# Altium project FMC_SDR_XFE.PrjPcb (part 3 of 3)

## Sheet TGA3042.SchDoc: FMC SDR Frontend
size 420 x 297 mm; CheckedBy: -; CompanyName: CERN; DrawnBy: DrawnBy; Organization: CERN; Address1: European Organization for Nuclear Research; Address2: CH-1211 Genčve 23 - Switzerland; Revision: -; SheetNumber: -; SheetTotal: -; EDA_Number: EDA-XXXXX-VX-X; Projet: -; ModifiedBy: -; CreateDate: XX/XX/XXXX; CheckedDate: -; Title2: Power Amplifier; DivGrp: TE/MPE; Designer: Designer; ModifiedDate: -
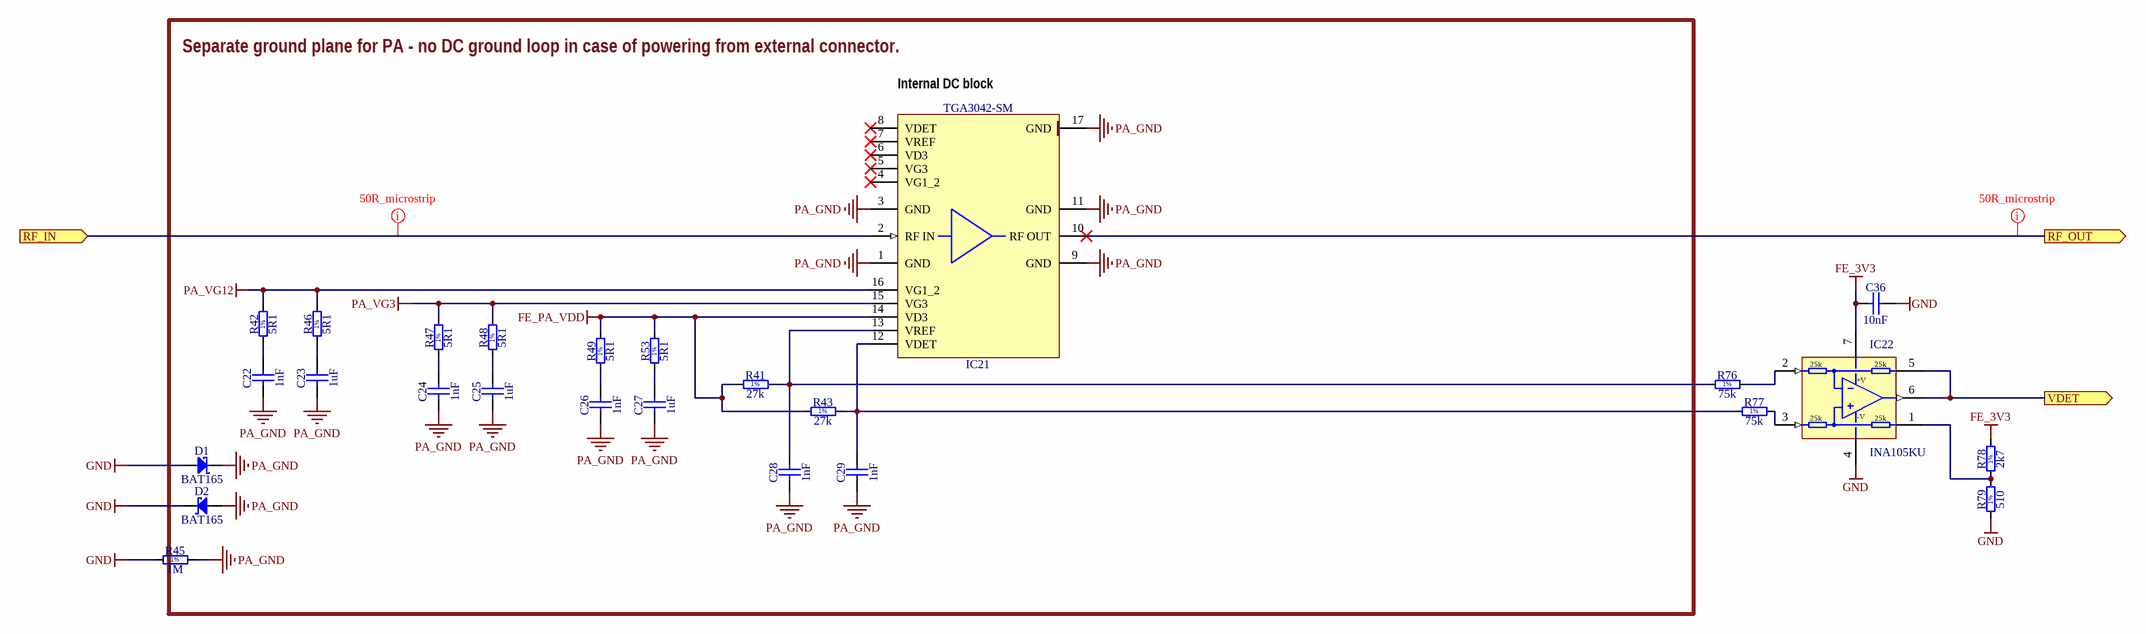
[diagram p9: TGA3042.SchDoc]

### Parts
C22  1nF  [CAPC1005X55N]
C23  1uF  [CAPC3216X140N]
C24  1nF  [CAPC1005X55N]
C25  1uF  [CAPC3216X140N]
C26  1nF  [CAPC1005X55N]
C27  1uF  [CAPC3216X140N]
C28  1nF  [CAPC1005X55N]
C29  1nF  [CAPC1005X55N]
C36  10nF  [CAPC1005X55N]
D1  BAT165  [SOD2512X110N]
D2  BAT165  [SOD2512X110N]
IC21  TGA3042-SM  [QORVO_TGA3042-SM]
IC22  INA105KU  [SOIC127P600X175-8N]
R41  27k  [RESC1005X40N]
R42  5R1  [RESC1005X40N]
R43  27k  [RESC1005X40N]
R45  1M  [RESC1005X40N]
R46  5R1  [RESC1005X40N]
R47  5R1  [RESC1005X40N]
R48  5R1  [RESC1005X40N]
R49  5R1  [RESC1005X40N]
R53  5R1  [RESC1005X40N]
R76  75k  [RESC1608X55N]
R77  75k  [RESC1608X55N]
R78  2k7  [RESC1608X55N]
R79  510  [RESC1608X55N]

### Ports
RF_IN (in), RF_OUT (out), VDET (out)

### Nets
FE_3V3: C36.1 IC22.7(+VCC) R78.2
FE_PA_VDD: IC21.14(VD3) R41.1 R43.1 R49.2 R53.2
GND: C36.2 D1.2(A) D2.1(C) IC22.4(-VEE) R45.1 R79.1
PA_GND: C22.1 C23.1 C24.1 C25.1 C26.1 C27.1 C28.1 C29.1 D1.1(C) D2.2(A) IC21.1(GND) IC21.3(GND) IC21.9(GND) IC21.11(GND) IC21.17(GND) R45.2
PA_VG3: IC21.15(VG3) R47.2 R48.2
PA_VG12: IC21.16(VG1_2) R42.2 R46.2
Vdet: IC22.5(SENS) IC22.6(OUT) ; port VDET
NetC22_2: C22.2 R42.1
NetC23_2: C23.2 R46.1
NetC24_2: C24.2 R47.1
NetC25_2: C25.2 R48.1
NetC26_2: C26.2 R49.1
NetC27_2: C27.2 R53.1
NetC28_2: C28.2 IC21.13(VREF) R41.2 R76.1
NetC29_2: C29.2 IC21.12(VDET) R43.2 R77.1
NetFL1_1: IC21.10(RF_OUT) ; port RF_OUT
NetFL2_3: IC21.2(RF_IN) ; port RF_IN
NetIC22_1: IC22.1(REF) R78.1 R79.2
NetIC22_2: IC22.2(IN-) R76.2
NetIC22_3: IC22.3(IN+) R77.2

Not connected (* = marked no-connect by the designer): IC21 4(VG1_2)* 5(VG3)* 6(VD3)* 7(VREF)* 8(VDET)*

### Layout directives
net class 50R_class: NetFL1_1, NetFL2_3

### Notes on the sheet
- Separate ground plane for PA - no DC ground loop in case of powering from external connector.
- (near IC21) Internal DC block
- Project/Equipment
- Document
- Designer
- Drawn by
- Check.by
- File
- Last Mod.
- Print Date
- Sheet
- Size
- A3
- of
- Rev
- (in symbol INA105KU) 25k; +V; -V
- (in symbol R0402_1M_1%_0.0625W_100PPM) 1%
- (in symbol R0402_5R1_1%_0.0625W_100PPM) 1%
- (in symbol R0402_27K_1%_0.0625W_100PPM) 1%
- (in symbol R0603_2K7_1%_0.1W_100PPM) 1%
- (in symbol R0603_75K_1%_0.1W_100PPM) 1%
- (in symbol R0603_510R_1%_0.1W_100PPM) 1%

### Library data of the parts
C22 C24 C26 C28 C29 = CC0402_1NF_50V_10%_X7R: as C14 on sheet FrontEnd; Part Number: CC0402_1NF_50V_10%_X7R; Component Kind: Standard; Component Type: Standard; Pin Count: 2; Value: 1nF; Status: Not Recommended; Manufacturer Part Number: CC0402_1NF_50V_10%_X7R; Case: 0402; Mounted: Yes; Socket: No; SMD: Yes; Sense: No; Manufacturer1 Example: PHYCOMP; Manufacturer1 ComponentHeight: 0.55mm; HelpURL: \\cern.ch\dfs\Applications\Altium\Datasheets\CC0402_X7R_PHYCOMP.pdf; Author: CERN DEM JLC; CreateDate: 03.12.2007; LatestRevisionDate: 03.12.2007
C23 C25 C27 = CC1206_1UF_50V_10%_X7R: Non-polarised capacitor; Part Description: SMD Multilayer Chip Ceramic Capacitor; Manufacturer: GENERIC; Manufacturer1 Part Number: C1206F105K5RACTU; Voltage: 50V; TC: X7R; Tolerance: ±10%; Part Number: CC1206_1UF_50V_10%_X7R; Component Kind: Standard; Component Type: Standard; Pin Count: 2; Value: 1uF; Status: Preferred; Manufacturer Part Number: CC1206_1UF_50V_10%_X7R; Case: 1206; Mounted: Yes; Socket: No; SMD: Yes; Sense: No; Manufacturer1 Example: KEMET; Manufacturer1 ComponentHeight: 1.8mm; HelpURL: \\cern.ch\dfs\Applications\Altium\Datasheets\CC1206_X7R_KEMET_OPENMODE.pdf; Author: CERN DEM JLC; CreateDate: 07.11.2012; LatestRevisionDate: 07.11.2012
C36 = CC0402_10NF_50V_10%_X7R: as C69 on sheet FrontEnd_PS; Part Number: CC0402_10NF_50V_10%_X7R; Component Kind: Standard; Component Type: Standard; Pin Count: 2; Value: 10nF; Status: None; Manufacturer Part Number: CC0402_10NF_50V_10%_X7R; Case: 0402; Mounted: Yes; Socket: No; SMD: Yes; Sense: No; Manufacturer1 Example: MURATA; Manufacturer1 ComponentHeight: 0.55mm; HelpURL: \\cern.ch\dfs\Applications\Altium\Datasheets\CC0402_X7R_MURATA_GRM.pdf; Author: CERN DEM MR; CreateDate: 08.01.2016; LatestRevisionDate: 08.01.2016
D1 D2 = BAT165: Schottky Diode; Part Description: Medium Power AF Schottky Diode; Manufacturer: INFINEON; Voltage: 40V; Power: 750mA; PressFit: No; Bonding: No; Part Number: BAT165; Component Kind: Standard; Component Type: Standard; Device: BAT165; PackageDescription: Small Outline Diode (SOD-323), 1.70mm W X 1.25mm L X 1.10mm H body,  IPC Medium Density; Manufacturer Part Number: BAT165; Pin Count: 2; Case: SOD323; Mounted: Yes; Socket: No; SMD: Yes; Sense: No; ComponentHeight: 1.1mm; HelpURL: \\cern.ch\dfs\Applications\Altium\Datasheets\BAT165.pdf; Author: CERN DEM JLC; CreateDate: 12.11.2014; LatestRevisionDate: 12.11.2014
IC21 = TGA3042-SM: 7-10.5GHz 4.5W GaN Power Amplifier; Manufacturer: QORVO; PressFit: No; Bonding: No; Part Number: TGA3042-SM; Component Kind: Standard; Component Type: Standard; Device: TGA3042-SM; PackageDescription: QFN, 0.566mm Pitch X, 0.525 Pitch Y, Square; 16 Pin, 4.5mm L X 4.5mm W X 1.74mm H Body; Part Description: 7-10.5GHz 4.5W GaN Power Amplifier; Manufacturer Part Number: TGA3042-SM; Pin Count: 17; Case: QFN16; Mounted: Yes; Socket: No; SMD: Yes; Sense: No; ComponentHeight: 1.91mm; Author: CERN DEM JLC; HelpURL: \\cern.ch\dfs\Applications\Altium\Datasheets\TGA3042-SM.pdf; CreateDate: 26.03.2019; LatestRevisionDate: 26.03.2019
IC22 = INA105KU: Precision, Unity-Gain Differential Amplifier; Manufacturer: TEXAS INSTRUMENTS; PressFit: No; Bonding: No; Part Number: INA105KU; Component Kind: Standard; Component Type: Standard; Device: INA105KU; PackageDescription: SOIC 8, Pitch 1.27mm, Body 4x5mm, IPC Medium Density; Part Description: Precision, Unity-Gain Differential Amplifier; Manufacturer Part Number: INA105KU; Pin Count: 7; Case: SOIC8; Mounted: Yes; Socket: No; SMD: Yes; Sense: No; ComponentHeight: 1.75mm; Author: CERN DEM JLC; HelpURL: \\cern.ch\dfs\Applications\Altium\Datasheets\INA105KU.pdf; CreateDate: 07.01.2008; LatestRevisionDate: 07.01.2008
R41 R43 = R0402_27K_1%_0.0625W_100PPM: Resistor - 1%; Part Description: General Purpose Thick Film Chip Resistor; Manufacturer: GENERIC; Manufacturer1 Part Number: 232270672703L; TC: ±100ppm/°C; PressFit: No; Part Number: R0402_27K_1%_0.0625W_100PPM; Component Kind: Standard; Component Type: Standard; Pin Count: 2; Value: 27k; Status: Not Recommended; Power: 0.0625W; Tolerance: ±1%; Manufacturer Part Number: R0402_27K_1%_0.0625W_100PPM; Case: 0402; Mounted: Yes; Sense: No; Socket: No; SMD: Yes; Manufacturer1 Example: YAGEO PHYCOMP; Manufacturer1 ComponentHeight: 0.4mm; HelpURL: \\cern.ch\dfs\Applications\Altium\Datasheets\R0402_Phycomp_RC0402.pdf; Author: CERN DEM JLC; CreateDate: 03.12.2007; LatestRevisionDate: 17.10.2012
R42 R46-R49 R53 = R0402_5R1_1%_0.0625W_100PPM: Resistor - 1%; Part Description: General Purpose Thick Film Chip Resistor; Manufacturer: GENERIC; Manufacturer1 Part Number: CRCW04025R10FKED; TC: ±100ppm/°C; PressFit: No; Part Number: R0402_5R1_1%_0.0625W_100PPM; Component Kind: Standard; Component Type: Standard; Pin Count: 2; Value: 5R1; Status: Not Recommended; Power: 0.0625W; Tolerance: ±1%; Manufacturer Part Number: R0402_5R1_1%_0.0625W_100PPM; Case: 0402; Mounted: Yes; Sense: No; Socket: No; SMD: Yes; Manufacturer1 Example: VISHAY; Manufacturer1 ComponentHeight: 0.4mm; HelpURL: \\cern.ch\dfs\Applications\Altium\Datasheets\R0402_VISHAY_CRCW e3.pdf; Author: CERN DEM MR; CreateDate: 22.11.2016; LatestRevisionDate: 22.11.2016
R45 = R0402_1M_1%_0.0625W_100PPM: Resistor - 1%; Part Description: General Purpose Thick Film Chip Resistor; Manufacturer: GENERIC; Manufacturer1 Part Number: 232270671005L; TC: ±100ppm/°C; PressFit: No; Part Number: R0402_1M_1%_0.0625W_100PPM; Component Kind: Standard; Component Type: Standard; Pin Count: 2; Value: 1M; Status: Not Recommended; Power: 0.0625W; Tolerance: ±1%; Manufacturer Part Number: R0402_1M_1%_0.0625W_100PPM; Case: 0402; Mounted: Yes; Sense: No; Socket: No; SMD: Yes; Manufacturer1 Example: YAGEO PHYCOMP; Manufacturer1 ComponentHeight: 0.4mm; HelpURL: \\cern.ch\dfs\Applications\Altium\Datasheets\R0402_Phycomp_RC0402.pdf; Author: CERN DEM JLC; CreateDate: 03.12.2007; LatestRevisionDate: 17.10.2012
R76 R77 = R0603_75K_1%_0.1W_100PPM: Resistor - 1%; Part Description: General Purpose Thick Film Chip Resistor; Manufacturer: GENERIC; Manufacturer1 Part Number: NRC06F7502TRF; Power: 0.1W; TC: ±100ppm/°C; PressFit: No; Part Number: R0603_75K_1%_0.1W_100PPM; Component Kind: Standard; Component Type: Standard; Pin Count: 2; Value: 75k; Status: Preferred; Tolerance: ±1%; Manufacturer Part Number: R0603_75K_1%_0.1W_100PPM; Case: 0603; Mounted: Yes; Sense: No; Socket: No; SMD: Yes; Manufacturer1 Example: NIC COMPONENT; Manufacturer1 ComponentHeight: 0.55mm; HelpURL: \\cern.ch\dfs\Applications\Altium\Datasheets\R0603_NIC_NRC.pdf; Author: CERN DEM JLC; CreateDate: 03.12.2007; LatestRevisionDate: 13.03.2008
R78 = R0603_2K7_1%_0.1W_100PPM: Resistor - 1%; Part Description: General Purpose Thick Film Chip Resistor; Manufacturer: GENERIC; Manufacturer1 Part Number: RC0603FR-072K7L; Power: 0.1W; TC: ±100ppm/°C; PressFit: No; Part Number: R0603_2K7_1%_0.1W_100PPM; Component Kind: Standard; Component Type: Standard; Pin Count: 2; Value: 2k7; Status: Preferred; Tolerance: ±1%; Manufacturer Part Number: R0603_2K7_1%_0.1W_100PPM; Case: 0603; Mounted: Yes; Sense: No; Socket: No; SMD: Yes; Manufacturer1 Example: YAGEO PHYCOMP; Manufacturer1 ComponentHeight: 0.55mm; HelpURL: \\cern.ch\dfs\Applications\Altium\Datasheets\R0603_PHYCOMP_RC0603.pdf; Author: CERN DEM JLC; CreateDate: 02.05.2011; LatestRevisionDate: 02.05.2011
R79 = R0603_510R_1%_0.1W_100PPM: Resistor - 1%; Part Description: General Purpose Thick Film Chip Resistor; Manufacturer: GENERIC; Manufacturer1 Part Number: CRCW0603510RFKEA; Power: 0.1W; TC: ±100ppm/°C; PressFit: No; Part Number: R0603_510R_1%_0.1W_100PPM; Component Kind: Standard; Component Type: Standard; Pin Count: 2; Value: 510; Status: Preferred; Tolerance: ±1%; Manufacturer Part Number: R0603_510R_1%_0.1W_100PPM; Case: 0603; Mounted: Yes; Sense: No; Socket: No; SMD: Yes; Manufacturer1 Example: VISHAY; Manufacturer1 ComponentHeight: 0.5mm; HelpURL: \\cern.ch\dfs\Applications\Altium\Datasheets\R0603_VISHAY_CRCW e3.pdf; Author: CERN DEM JLC; CreateDate: 03.12.2007; LatestRevisionDate: 21.03.2018

## Sheet PLL.SchDoc: FMC SDR Frontend
size 420 x 297 mm; CheckedBy: -; CompanyName: CERN; DrawnBy: DrawnBy; Organization: CERN; Address1: European Organization for Nuclear Research; Address2: CH-1211 Genčve 23 - Switzerland; Revision: -; SheetNumber: -; SheetTotal: -; EDA_Number: EDA-XXXXX-VX-X; Projet: -; ModifiedBy: -; CreateDate: XX/XX/XXXX; CheckedDate: -; Title2: PLL; DivGrp: TE/MPE; Designer: Designer; ModifiedDate: -
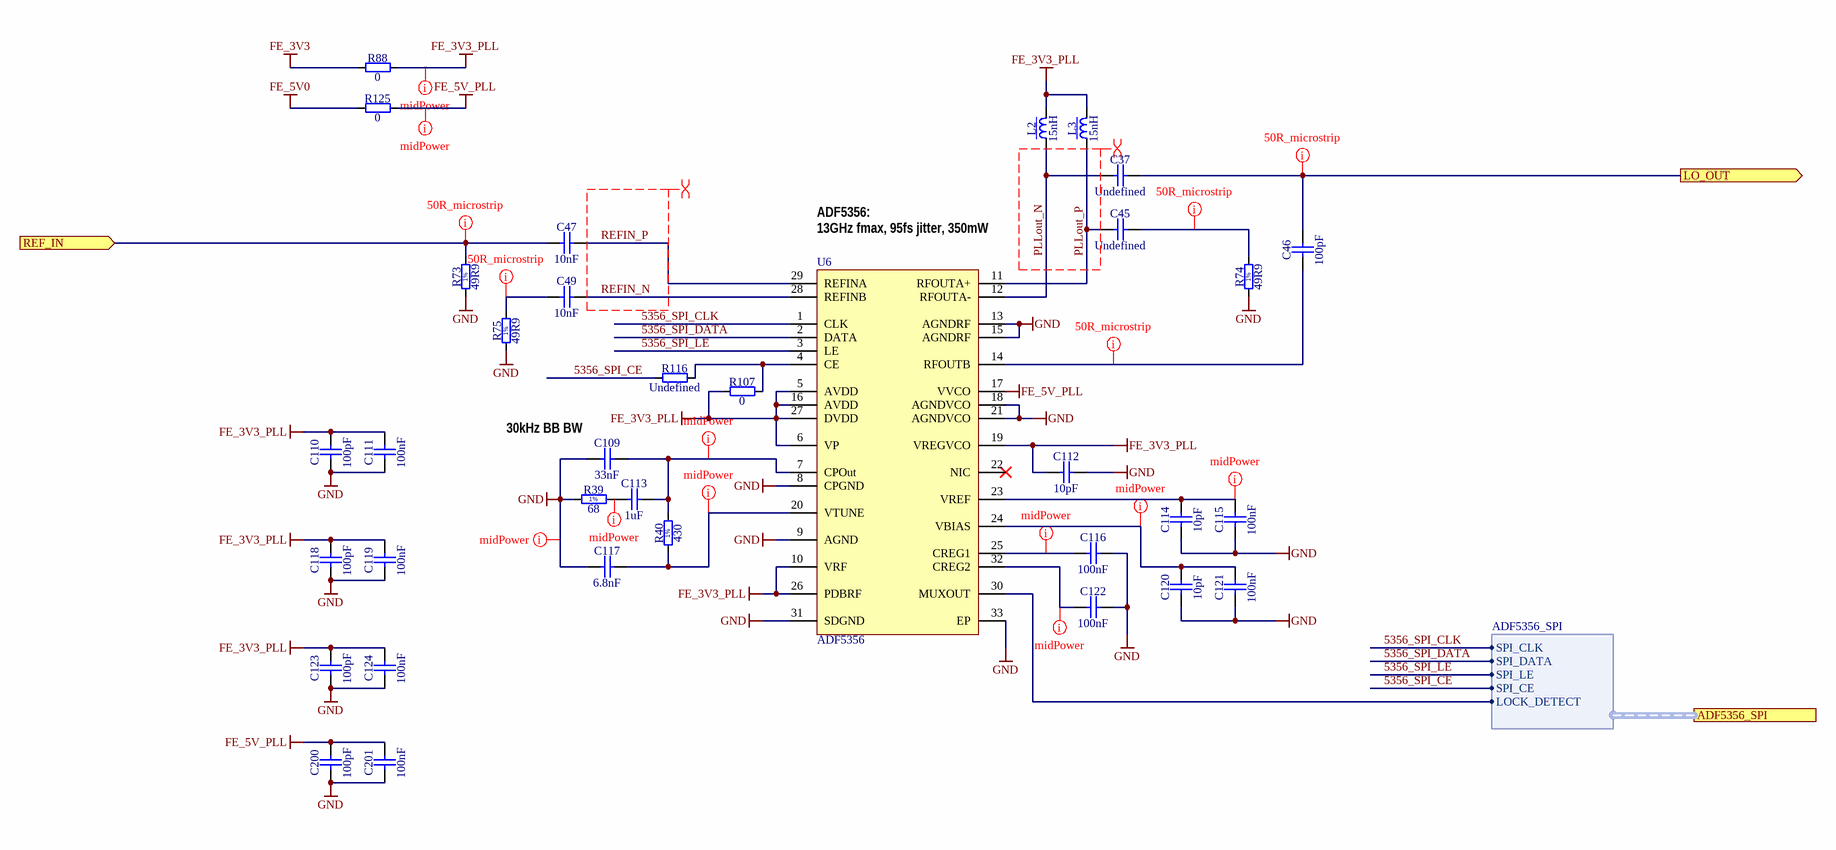
[diagram p10: PLL.SchDoc]

### Parts
C37  Undefined  [CAPC1005X55N]
C45  Undefined  [CAPC1005X55N]
C46  100pF  [CAPC1005X55N]
C47  10nF  [CAPC1005X55N]
C49  10nF  [CAPC1005X55N]
C109  33nF  [CAPC2012X135N]
C110  100pF  [CAPC1005X55N]
C111  100nF  [CAPC1005X55N]
C112  10pF  [CAPC1005X55N]
C113  1uF  [CAPC3216X140N]
C114  10pF  [CAPC1005X55N]
C115  100nF  [CAPC1005X55N]
C116  100nF  [CAPC1005X55N]
C117  6.8nF  [CAPC2012X135N]
C118  100pF  [CAPC1005X55N]
C119  100nF  [CAPC1005X55N]
C120  10pF  [CAPC1005X55N]
C121  100nF  [CAPC1005X55N]
C122  100nF  [CAPC1005X55N]
C123  100pF  [CAPC1005X55N]
C124  100nF  [CAPC1005X55N]
C200  100pF  [CAPC1005X55N]
C201  100nF  [CAPC1005X55N]
L2  15nH  [IND_COILCRAFT_0402DC]
L3  15nH  [IND_COILCRAFT_0402DC]
R39  68  [RESC1608X55N]
R40  430  [RESC1608X55N]
R73  49R9  [RESC1005X40N]
R74  49R9  [RESC1005X40N]
R75  49R9  [RESC1005X40N]
R88  0  [RESC1608X55N]
R107  0  [RESC1005X40N]
R116  Undefined  [RESC1005X40N]
R125  0  [RESC1608X55N]
U6  ADF5356  [ADF3356]

### Ports
ADF5356_SPI (harness ADF5356_SPI), LO_OUT (out), REF_IN (in)

### Harnesses
ADF5356_SPI: SPI_CLK, SPI_DATA, SPI_LE, LOCK_DETECT, SPI_CE

### Nets
FE_3V3: R88.1
FE_3V3_PLL: C110.2 C111.2 C112.1 C118.2 C119.2 C123.2 C124.2 L2.2 L3.2 R88.2 R107.1 U6.5(AVDD) U6.6(VP) U6.10(VRF) U6.16(AVDD) U6.19(VREGVCO) U6.26(PDBRF) U6.27(DVDD)
FE_5V0: R125.1
FE_5V_PLL: C200.2 C201.2 R125.2 U6.17(VVCO)
GND: C109.1 C110.1 C111.1 C112.2 C114.1 C115.1 C116.2 C117.1 C118.1 C119.1 C120.1 C121.1 C122.2 C123.1 C124.1 C200.1 C201.1 R39.1 R73.1 R74.1 R75.1 U6.8(CPGND) U6.9(AGND) U6.13(AGNDRF) U6.15(AGNDRF) U6.18(AGNDVCO) U6.21(AGNDVCO) U6.31(SDGND) U6.33(EP)
5356_SPI_CE: R116.1 ; port ADF5356_SPI.SPI_CE
5356_SPI_CLK: U6.1(CLK) ; port ADF5356_SPI.SPI_CLK
5356_SPI_DATA: U6.2(DATA) ; port ADF5356_SPI.SPI_DATA
5356_SPI_LE: U6.3(LE) ; port ADF5356_SPI.SPI_LE
LOCK_DETECT: U6.30(MUXOUT) ; port ADF5356_SPI.LOCK_DETECT
PLLout_N: C37.1 L2.1 U6.12(RFOUTA-)
PLLout_P: C45.1 L3.1 U6.11(RFOUTA+)
REFIN_N: C49.2 U6.28(REFINB)
REFIN_P: C47.2 U6.29(REFINA)
NetC37_2: C37.2 C46.2 ; port LO_OUT
NetC45_2: C45.2 R74.2
NetC46_1: C46.1 U6.14(RFOUTB)
NetC47_1: C47.1 R73.2 ; port REF_IN
NetC49_1: C49.1 R75.2
NetC109_2: C109.2 C113.2 R40.2 U6.7(CPOut)
NetC113_1: C113.1 R39.2
NetC114_2: C114.2 C115.2 U6.23(VREF)
NetC116_1: C116.1 U6.25(CREG1)
NetC117_2: C117.2 R40.1 U6.20(VTUNE)
NetC120_2: C120.2 C121.2 U6.24(VBIAS)
NetC122_1: C122.1 U6.32(CREG2)
NetR107_2: R107.2 R116.2 U6.4(CE)

Not connected (* = marked no-connect by the designer): U6 22(NIC)*

### Layout directives
net class 50R_class: NetC37_2, NetC45_2, NetC46_1, NetC47_1, NetC49_1
differential pair; differential pair class 100R_diff: PLLout_N, PLLout_P, REFIN_N, REFIN_P
net class midPower: FE_3V3_PLL, FE_5V_PLL, GND, NetC109_2, NetC113_1, NetC114_2, NetC116_1, NetC117_2, NetC120_2, NetC122_1

### Notes on the sheet
- (near U6) ADF5356:
  13GHz fmax, 95fs jitter, 350mW
- (near C109) 30kHz BB BW
- Project/Equipment
- Document
- Designer
- Drawn by
- Check.by
- File
- Last Mod.
- Print Date
- Sheet
- Size
- A3
- of
- Rev
- (in symbol R0402_49R9_1%_0.0625W_100PPM) 1%
- (in symbol R0603_68R_1%_0.1W_100PPM) 1%
- (in symbol R0603_430R_1%_0.1W_100PPM) 1%

### Library data of the parts
C37 C45 = CC0402_NO-VALUE: Non-polarised capacitor; Part Description: Reserved Footprint For 0402(1005) Chip Ceramic Capacitor; Mounted: No; Part Number: CC0402_NO-VALUE; Component Kind: Standard; Component Type: Standard; Pin Count: 2; Value: Undefined; Status: None; Manufacturer: Undefined; Manufacturer Part Number: CC0402_NO-VALUE; Case: 0402; Socket: No; SMD: Yes; Sense: No; Manufacturer1 ComponentHeight: 0.55mm; HelpURL: Undefined; Author: CERN DEM JLC; CreateDate: 14.01.2014; LatestRevisionDate: 14.01.2014
C46 C110 C118 C123 C200 = CC0402_100PF_50V_5%_C0G: Non-polarised capacitor; Part Description: SMD Multilayer Chip Ceramic Capacitor; Manufacturer: GENERIC; Manufacturer1 Part Number: C0402C101J5GACTU; Voltage: 50V; TC: C0G/NP0; Tolerance: ±5%; Part Number: CC0402_100PF_50V_5%_C0G; Component Kind: Standard; Component Type: Standard; Pin Count: 2; Value: 100pF; Status: Preferred; Manufacturer Part Number: CC0402_100PF_50V_5%_C0G; Case: 0402; Mounted: Yes; Socket: No; SMD: Yes; Sense: No; Manufacturer1 Example: KEMET; Manufacturer1 ComponentHeight: 0.55mm; HelpURL: \\cern.ch\dfs\Applications\Altium\Datasheets\CC0805_C0G_KEMET_(Commercial Grade).pdf; Author: CERN DEM JLC; CreateDate: 03.12.2007; LatestRevisionDate: 22.04.2015
C47 C49 = CC0402_10NF_50V_10%_X7R: Non-polarised capacitor; Part Description: SMD Multilayer Chip Ceramic Capacitor; Manufacturer: GENERIC; Manufacturer1 Part Number: GRM155R71H103KA88D; Voltage: 50V; TC: X7R; Tolerance: ±10%; Part Number: CC0402_10NF_50V_10%_X7R; Component Kind: Standard; Component Type: Standard; Pin Count: 2; Value: 10nF; Status: None; Manufacturer Part Number: CC0402_10NF_50V_10%_X7R; Case: 0402; Mounted: Yes; Socket: No; SMD: Yes; Sense: No; Manufacturer1 Example: MURATA; Manufacturer1 ComponentHeight: 0.55mm; HelpURL: \\cern.ch\dfs\Applications\Altium\Datasheets\CC0402_X7R_MURATA_GRM.pdf; Author: CERN DEM MR; CreateDate: 08.01.2016; LatestRevisionDate: 08.01.2016
C109 = CC0805_33NF_25V_10%_X7R: Non-polarised capacitor; Part Description: SMD Multilayer Chip Ceramic Capacitor; Manufacturer: GENERIC; Manufacturer1 Part Number: 223891015643; Voltage: 25V; TC: X7R; Tolerance: ±10%; Part Number: CC0805_33NF_25V_10%_X7R; Component Kind: Standard; Component Type: Standard; Pin Count: 2; Value: 33nF; Status: Preferred; Manufacturer Part Number: CC0805_33NF_25V_10%_X7R; Case: 0805; Mounted: Yes; Socket: No; SMD: Yes; Sense: No; Manufacturer1 Example: PHYCOMP; Manufacturer1 ComponentHeight: 1.35mm; HelpURL: \\cern.ch\dfs\Applications\Altium\Datasheets\CC0805_X7R_PHYCOMP.pdf; Author: CERN DEM JLC; CreateDate: 03.12.2007; LatestRevisionDate: 03.12.2007
C111 C115 C116 C119 C121 C122 C124 C201 = CC0402_100NF_50V_10%_X7R: Non-polarised capacitor; Part Description: SMD Multilayer Chip Ceramic Capacitor; Manufacturer: GENERIC; Manufacturer1 Part Number: GRM155R71H104KE14D; Voltage: 50V; TC: X7R; Tolerance: ±10%; Part Number: CC0402_100NF_50V_10%_X7R; Component Kind: Standard; Component Type: Standard; Pin Count: 2; Value: 100nF; Status: None; Manufacturer Part Number: CC0402_100NF_50V_10%_X7R; Case: 0402; Mounted: Yes; Socket: No; SMD: Yes; Sense: No; Manufacturer1 Example: MURATA; Manufacturer1 ComponentHeight: 0.55mm; HelpURL: \\cern.ch\dfs\Applications\Altium\Datasheets\CC0402_MURATA_GRM155R71H104KE14D.pdf; Author: CERN DEM MR; CreateDate: 30.06.2017; LatestRevisionDate: 30.06.2017
C112 C114 C120 = CC0402_10PF_50V_5%_C0G: Non-polarised capacitor; Part Description: SMD Multilayer Chip Ceramic Capacitor; Manufacturer: GENERIC; Manufacturer1 Part Number: C0402C100J5GACTU; Voltage: 50V; TC: C0G/NP0; Tolerance: ±5%; Part Number: CC0402_10PF_50V_5%_C0G; Component Kind: Standard; Component Type: Standard; Pin Count: 2; Value: 10pF; Status: Preferred; Manufacturer Part Number: CC0402_10PF_50V_5%_C0G; Case: 0402; Mounted: Yes; Socket: No; SMD: Yes; Sense: No; Manufacturer1 Example: KEMET; Manufacturer1 ComponentHeight: 0.55mm; HelpURL: \\cern.ch\dfs\Applications\Altium\Datasheets\CC0805_C0G_KEMET_(Commercial Grade).pdf; Author: CERN DEM JLC; CreateDate: 03.12.2007; LatestRevisionDate: 22.04.2015
C113 = CC1206_1UF_25V_10%_X7R: Non-polarised capacitor; Part Description: SMD Multilayer Chip Ceramic Capacitor; Manufacturer: GENERIC; Manufacturer1 Part Number: C1206C105K3RAC; Voltage: 25V; TC: X7R; Tolerance: ±10%; Part Number: CC1206_1UF_25V_10%_X7R; Component Kind: Standard; Component Type: Standard; Pin Count: 2; Value: 1uF; Status: Preferred; Manufacturer Part Number: CC1206_1UF_25V_10%_X7R; Case: 1206; Mounted: Yes; Socket: No; SMD: Yes; Sense: No; Manufacturer1 Example: KEMET; Manufacturer1 ComponentHeight: 1.75mm; HelpURL: \\cern.ch\dfs\Applications\Altium\Datasheets\CC1206_X7R_KEMET.pdf; Author: CERN DEM JLC; CreateDate: 03.12.2007; LatestRevisionDate: 03.12.2007
C117 = CC0805_6.8NF_50V_10%_X7R: Non-polarised capacitor; Part Description: SMD Multilayer Chip Ceramic Capacitor; Manufacturer: GENERIC; Manufacturer1 Part Number: 223858615634; Voltage: 50V; TC: X7R; Tolerance: ±10%; Part Number: CC0805_6.8NF_50V_10%_X7R; Component Kind: Standard; Component Type: Standard; Pin Count: 2; Value: 6.8nF; Status: Preferred; Manufacturer Part Number: CC0805_6.8NF_50V_10%_X7R; Case: 0805; Mounted: Yes; Socket: No; SMD: Yes; Sense: No; Manufacturer1 Example: PHYCOMP; Manufacturer1 ComponentHeight: 1.35mm; HelpURL: \\cern.ch\dfs\Applications\Altium\Datasheets\CC0805_X7R_PHYCOMP.pdf; Author: CERN DEM JLC; CreateDate: 03.12.2007; LatestRevisionDate: 03.12.2007
L2 L3 = IND0402_15NH_2%_COILCRAFT_0402DC: Inductor With Core; Part Description: Ceramic Wirewound Chip Inductor, 0402DC Series; Manufacturer Part Number: 0402DC-15NXGRW; Power: 1A; Resistance: 0.115R; Tolerance: ±2%; Part Number: IND0402_15NH_2%_COILCRAFT_0402DC; Component Kind: Standard; Component Type: Standard; Pin Count: 2; Value: 15nH; Status: None; Manufacturer: COILCRAFT; Case: 0402; Mounted: Yes; Socket: No; SMD: Yes; Sense: No; ComponentHeight: 0.61mm; HelpURL: \\cern.ch\dfs\Applications\Altium\Datasheets\IND0402_COILCRAFT_0402DC.pdf; Author: CERN DEM JLC; CreateDate: 04.12.2018; LatestRevisionDate: 04.12.2018
R39 = R0603_68R_1%_0.1W_100PPM: Resistor - 1%; Part Description: General Purpose Thick Film Chip Resistor; Manufacturer: GENERIC; Manufacturer1 Part Number: NRC06F68R0TRF; Power: 0.1W; TC: ±100ppm/°C; PressFit: No; Part Number: R0603_68R_1%_0.1W_100PPM; Component Kind: Standard; Component Type: Standard; Pin Count: 2; Value: 68; Status: Preferred; Tolerance: ±1%; Manufacturer Part Number: R0603_68R_1%_0.1W_100PPM; Case: 0603; Mounted: Yes; Sense: No; Socket: No; SMD: Yes; Manufacturer1 Example: NIC COMPONENT; Manufacturer1 ComponentHeight: 0.55mm; HelpURL: \\cern.ch\dfs\Applications\Altium\Datasheets\R0603_NIC_NRC.pdf; Author: CERN DEM JLC; CreateDate: 03.12.2007; LatestRevisionDate: 13.03.2008
R40 = R0603_430R_1%_0.1W_100PPM: Resistor - 1%; Part Description: General Purpose Thick Film Chip Resistor; Manufacturer: GENERIC; Manufacturer1 Part Number: NRC06F4300TRF; Power: 0.1W; TC: ±100ppm/°C; PressFit: No; Part Number: R0603_430R_1%_0.1W_100PPM; Component Kind: Standard; Component Type: Standard; Pin Count: 2; Value: 430; Status: Preferred; Tolerance: ±1%; Manufacturer Part Number: R0603_430R_1%_0.1W_100PPM; Case: 0603; Mounted: Yes; Sense: No; Socket: No; SMD: Yes; Manufacturer1 Example: NIC COMPONENT; Manufacturer1 ComponentHeight: 0.55mm; HelpURL: \\cern.ch\dfs\Applications\Altium\Datasheets\R0603_NIC_NRC.pdf; Author: CERN DEM JLC; CreateDate: 03.12.2007; LatestRevisionDate: 13.03.2008
R73-R75 = R0402_49R9_1%_0.0625W_100PPM: Resistor - 1%; Part Description: General Purpose Thick Film Chip Resistor; Manufacturer: GENERIC; Manufacturer1 Part Number: 232270674999L or RC0402FR-0749R9L; TC: ±100ppm/°C; PressFit: No; Part Number: R0402_49R9_1%_0.0625W_100PPM; Component Kind: Standard; Component Type: Standard; Pin Count: 2; Value: 49R9; Status: Not Recommended; Power: 0.0625W; Tolerance: ±1%; Manufacturer Part Number: R0402_49R9_1%_0.0625W_100PPM; Case: 0402; Mounted: Yes; Sense: No; Socket: No; SMD: Yes; Manufacturer1 Example: YAGEO PHYCOMP; Manufacturer1 ComponentHeight: 0.4mm; HelpURL: \\cern.ch\dfs\Applications\Altium\Datasheets\R0402_Phycomp_RC0402.pdf; Author: CERN DEM JLC; CreateDate: 24.10.2012; LatestRevisionDate: 24.10.2012
R88 R125 = R0603_0R_JUMPER: Resistor; Part Description: 1A (0.05R Max DC Resistance) Zero Ohm Jumper; Manufacturer: GENERIC; Manufacturer1 Part Number: NRC06Z0; PressFit: No; Part Number: R0603_0R_JUMPER; Component Kind: Standard; Component Type: Standard; Pin Count: 2; Value: 0; Status: Preferred; Manufacturer Part Number: R0603_0R_JUMPER; Case: 0603; Mounted: Yes; Sense: No; Socket: No; SMD: Yes; Manufacturer1 Example: NIC COMPONENT; Manufacturer1 ComponentHeight: 0.55mm; HelpURL: \\cern.ch\dfs\Applications\Altium\Datasheets\R0603_NIC_NRC.pdf; Author: CERN DEM JLC; CreateDate: 03.12.2007; LatestRevisionDate: 13.03.2008
R107 = R0402_0R_JUMPER: Resistor; Part Description: 1A (0.05R Max DC Resistance) Zero Ohm Jumper; Manufacturer: GENERIC; Manufacturer1 Part Number: 232270591001L; PressFit: No; Part Number: R0402_0R_JUMPER; Component Kind: Standard; Component Type: Standard; Pin Count: 2; Value: 0; Status: Not Recommended; Manufacturer Part Number: R0402_0R_JUMPER; Case: 0402; Mounted: Yes; Sense: No; Socket: No; SMD: Yes; Manufacturer1 Example: YAGEO PHYCOMP; Manufacturer1 ComponentHeight: 0.4mm; HelpURL: \\cern.ch\dfs\Applications\Altium\Datasheets\R0402_Phycomp_RC0402.pdf; Author: CERN DEM JLC; CreateDate: 03.12.2007; LatestRevisionDate: 17.10.2012
R116 = R0402_NO-VALUE: Resistor; Part Description: Reserved Footprint For a 0402 (1005) Chip Resistor; PressFit: No; Mounted: No; Part Number: R0402_NO-VALUE; Component Kind: Standard; Component Type: Standard; Pin Count: 2; Value: Undefined; Status: None; Manufacturer: Undefined; Manufacturer Part Number: R0402_NO-VALUE; Case: 0402; Sense: No; Socket: No; SMD: Yes; Manufacturer1 Example: Undefined; Manufacturer1 Part Number: Undefined; Manufacturer1 ComponentHeight: Undefined; HelpURL: Undefined; Author: CERN DEM JLC; CreateDate: 03.12.2007; LatestRevisionDate: 13.03.2008

## Sheet Preamp.SchDoc: FMC SDR Frontend
size 420 x 297 mm; CheckedBy: -; CompanyName: CERN; DrawnBy: DrawnBy; Organization: CERN; Address1: European Organization for Nuclear Research; Address2: CH-1211 Genčve 23 - Switzerland; Revision: -; SheetNumber: -; SheetTotal: -; EDA_Number: EDA-XXXXX-VX-X; Projet: -; ModifiedBy: -; CreateDate: XX/XX/XXXX; CheckedDate: -; Title2: Preamplifier - general GND reference; DivGrp: TE/MPE; Designer: Designer; ModifiedDate: -
Used 3 times, as channels PreampLO_RX, PreampRX1, PreampRX2. Parts and nets are listed once, with the designators drawn on the sheet.
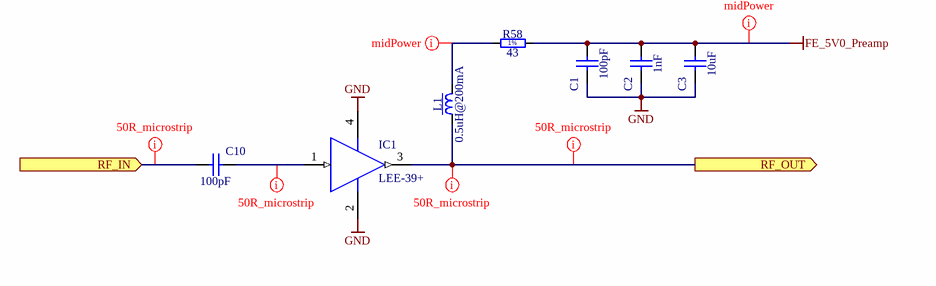
[diagram p11: Preamp.SchDoc]

### Parts
C1  100pF  [CAPC1005X55N]
C2  1nF  [CAPC1005X55N]
C3  10uF  [CAPC3216X180N]
C10  100pF  [CAPC1005X55N]
IC1  LEE-39+  [MINI-CIRCUITS_FG873]
L1  0.5uH@200mA  [IND_MINI-CIRCUITS_GU1604]
R58  43  [RESC1608X55N]

### Ports
RF_IN (in), RF_OUT (out)

### Nets
FE_5V0_Preamp: C1.2 C2.2 C3.2 R58.2
GND: C1.1 C2.1 C3.1 IC1.2(GND) IC1.4(GND)
RF_IN: C10.1 ; port RF_IN
RF_OUT: IC1.3(RF_OUT) L1.1 ; port RF_OUT
NetC10_2: C10.2 IC1.1(RF_IN)
NetL1_3: L1.3 R58.1

### Channels
PreampLO_RX: designators end in _PreampLO_RX; ports RF_IN=NetC10_PreampLO_RX_1 RF_OUT=NetC88_1
PreampRX1: designators end in _PreampRX1; ports RF_IN=NetC10_PreampRX1_1 RF_OUT=NetC10_PreampRX2_1
PreampRX2: designators end in _PreampRX2; ports RF_IN=NetC10_PreampRX2_1 RF_OUT=NetC87_1

### Layout directives
net class midPower: FE_5V0_Preamp, NetL1_PreampLO_RX_3
net class 50R_class: NetC10_PreampLO_RX_1, NetC10_PreampLO_RX_2, NetC88_1
net class 50R_class; rule Clearance Constraint [Generic clearance = 0.15mm, and 26 value(s) for objects]: NetC88_1

### Notes on the sheet
- Project/Equipment
- Document
- Designer
- Drawn by
- Check.by
- File
- Last Mod.
- Print Date
- Sheet
- Size
- A3
- of
- Rev
- (in symbol R0603_43R_1%_0.1W_100PPM) 1%

### Library data of the parts
C1 C10 = CC0402_100PF_50V_5%_C0G: as C46 on sheet PLL; Part Number: CC0402_100PF_50V_5%_C0G; Component Kind: Standard; Component Type: Standard; Pin Count: 2; Value: 100pF; Status: Preferred; Manufacturer Part Number: CC0402_100PF_50V_5%_C0G; Case: 0402; Mounted: Yes; Socket: No; SMD: Yes; Sense: No; Manufacturer1 Example: KEMET; Manufacturer1 ComponentHeight: 0.55mm; HelpURL: \\cern.ch\dfs\Applications\Altium\Datasheets\CC0805_C0G_KEMET_(Commercial Grade).pdf; Author: CERN DEM JLC; CreateDate: 03.12.2007; LatestRevisionDate: 22.04.2015
C2 = CC0402_1NF_50V_10%_X7R: Non-polarised capacitor; Part Description: SMD Multilayer Chip Ceramic Capacitor; Manufacturer: GENERIC; Manufacturer1 Part Number: 223858715623; Voltage: 50V; TC: X7R; Tolerance: ±10%; Part Number: CC0402_1NF_50V_10%_X7R; Component Kind: Standard; Component Type: Standard; Pin Count: 2; Value: 1nF; Status: Not Recommended; Manufacturer Part Number: CC0402_1NF_50V_10%_X7R; Case: 0402; Mounted: Yes; Socket: No; SMD: Yes; Sense: No; Manufacturer1 Example: PHYCOMP; Manufacturer1 ComponentHeight: 0.55mm; HelpURL: \\cern.ch\dfs\Applications\Altium\Datasheets\CC0402_X7R_PHYCOMP.pdf; Author: CERN DEM JLC; CreateDate: 03.12.2007; LatestRevisionDate: 03.12.2007
C3 = CC1206_10UF_25V_10%_X7R: Non-polarised capacitor; Part Description: SMD Multilayer Chip Ceramic Capacitor; Manufacturer: GENERIC; Manufacturer1 Part Number: C1206C106K4RACTU; Voltage: 25V; TC: X7R; Tolerance: ±10%; Part Number: CC1206_10UF_25V_10%_X7R; Component Kind: Standard; Component Type: Standard; Pin Count: 2; Value: 10uF; Status: Preferred; Manufacturer Part Number: CC1206_10uF_25V_10%_X7R; Case: 1206; Mounted: Yes; Socket: No; SMD: Yes; Sense: No; Manufacturer1 Example: KEMET; Manufacturer1 ComponentHeight: 1.8mm; HelpURL: \\cern.ch\dfs\Applications\Altium\Datasheets\CC1206_X7R_KEMET.pdf; Author: CERN DEM JLC; CreateDate: 12.09.2012; LatestRevisionDate: 12.09.2012
IC1 = LEE-39+: Monolithic Amplifier; Part Description: DC-8GHz Monolithic Amplifier; Manufacturer: MINI-CIRCUITS; PressFit: No; Bonding: No; Part Number: LEE-39+; Component Kind: Standard; Component Type: Standard; Device: LEE-39+; PackageDescription: MINI-CIRCUITS FG873 Case, 4 pin, 3.0mm W X 3.0mm L; Manufacturer Part Number: LEE-39+; Pin Count: 4; Mounted: Yes; Socket: No; SMD: Yes; Sense: No; ComponentHeight: 0.89mm; Author: CERN DEM JLC; HelpURL: \\cern.ch\dfs\Applications\Altium\Datasheets\LEE-39+.pdf; ComponentLink1URL: \\cern.ch\dfs\Applications\Altium\Datasheets\LEE-39+_Package-Drawing.pdf; ComponentLink1Description: Package Drawing; CreateDate: 17.01.2017; LatestRevisionDate: 17.01.2017
L1 = IND_MINI-CIRCUITS_TCCH-80+: 50 Ohms, 50 to 8200 MHz RF Choke; Power: 200mA; Resistance: 0.1R; Part Number: IND_MINI-CIRCUITS_TCCH-80+; Component Kind: Standard; Component Type: Standard; Pin Count: 4; Value: 0.5uH@200mA; Status: None; Part Description: 50 Ohms, 50 to 8200 MHz RF Choke; Manufacturer: MINI-CIRCUITS; Manufacturer Part Number: TCCH-80+; Mounted: Yes; Socket: No; SMD: Yes; Sense: No; ComponentHeight: 3.81mm; HelpURL: \\cern.ch\dfs\Applications\Altium\Datasheets\IND_MINI-CIRCUITS_TCCH-80+.pdf; Author: CERN DEM JLC; CreateDate: 19.12.2011; LatestRevisionDate: 19.12.2011
R58 = R0603_43R_1%_0.1W_100PPM: Resistor - 1%; Part Description: General Purpose Thick Film Chip Resistor; Manufacturer: GENERIC; Manufacturer1 Part Number: NRC06F43R0TRF; Power: 0.1W; TC: ±100ppm/°C; PressFit: No; Part Number: R0603_43R_1%_0.1W_100PPM; Component Kind: Standard; Component Type: Standard; Pin Count: 2; Value: 43; Status: Preferred; Tolerance: ±1%; Manufacturer Part Number: R0603_43R_1%_0.1W_100PPM; Case: 0603; Mounted: Yes; Sense: No; Socket: No; SMD: Yes; Manufacturer1 Example: NIC COMPONENT; Manufacturer1 ComponentHeight: 0.55mm; HelpURL: \\cern.ch\dfs\Applications\Altium\Datasheets\R0603_NIC_NRC.pdf; Author: CERN DEM JLC; CreateDate: 03.12.2007; LatestRevisionDate: 13.03.2008

## Sheet PreampTX.SchDoc: FMC SDR Frontend
size 420 x 297 mm; CheckedBy: -; CompanyName: CERN; DrawnBy: DrawnBy; Organization: CERN; Address1: European Organization for Nuclear Research; Address2: CH-1211 Genčve 23 - Switzerland; Revision: -; SheetNumber: -; SheetTotal: -; EDA_Number: EDA-XXXXX-VX-X; Projet: -; ModifiedBy: -; CreateDate: XX/XX/XXXX; CheckedDate: -; Title2: Preamplifier - PA GND reference; DivGrp: TE/MPE; Designer: Designer; ModifiedDate: -
Used 2 times, as channels PreampLO_TX, PreampTX. Parts and nets are listed once, with the designators drawn on the sheet.
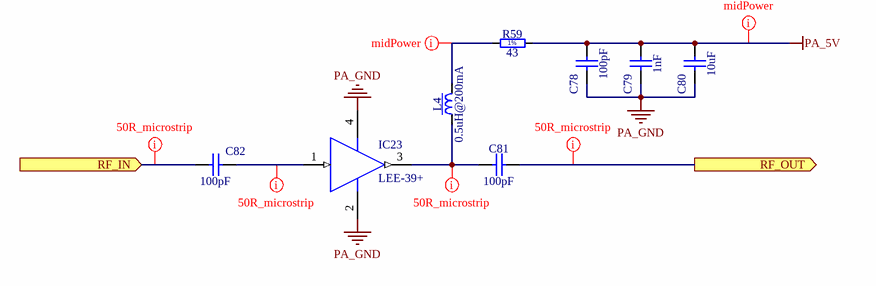
[diagram p12: PreampTX.SchDoc]

### Parts
C78  100pF  [CAPC1005X55N]
C79  1nF  [CAPC1005X55N]
C80  10uF  [CAPC3216X180N]
C81  100pF  [CAPC1005X55N]
C82  100pF  [CAPC1005X55N]
IC23  LEE-39+  [MINI-CIRCUITS_FG873]
L4  0.5uH@200mA  [IND_MINI-CIRCUITS_GU1604]
R59  43  [RESC1608X55N]

### Ports
RF_IN (in), RF_OUT (out)

### Nets
PA_5V: C78.2 C79.2 C80.2 R59.2
PA_GND: C78.1 C79.1 C80.1 IC23.2(GND) IC23.4(GND)
RF_IN: C82.1 ; port RF_IN
RF_OUT: C81.2 ; port RF_OUT
NetC81_1: C81.1 IC23.3(RF_OUT) L4.1
NetC82_2: C82.2 IC23.1(RF_IN)
NetL4_3: L4.3 R59.1

### Channels
PreampLO_TX: designators end in _PreampLO_TX; ports RF_IN=NetC82_PreampLO_TX_1 RF_OUT=LO_TX
PreampTX: designators end in _PreampTX; ports RF_IN=NetC82_PreampTX_1 RF_OUT=NetC81_PreampTX_2

### Layout directives
net class midPower: NetL4_PreampLO_TX_3, PA_5V
net class 50R_class: LO_TX, NetC82_PreampLO_TX_1, NetC82_PreampLO_TX_2
net class 50R_class; rule Clearance Constraint [Generic clearance = 0.15mm, and 26 value(s) for objects]: NetC81_PreampLO_TX_1

### Notes on the sheet
- Project/Equipment
- Document
- Designer
- Drawn by
- Check.by
- File
- Last Mod.
- Print Date
- Sheet
- Size
- A3
- of
- Rev
- (in symbol R0603_43R_1%_0.1W_100PPM) 1%

### Library data of the parts
C78 C81 C82 = CC0402_100PF_50V_5%_C0G: as C46 on sheet PLL; Part Number: CC0402_100PF_50V_5%_C0G; Component Kind: Standard; Component Type: Standard; Pin Count: 2; Value: 100pF; Status: Preferred; Manufacturer Part Number: CC0402_100PF_50V_5%_C0G; Case: 0402; Mounted: Yes; Socket: No; SMD: Yes; Sense: No; Manufacturer1 Example: KEMET; Manufacturer1 ComponentHeight: 0.55mm; HelpURL: \\cern.ch\dfs\Applications\Altium\Datasheets\CC0805_C0G_KEMET_(Commercial Grade).pdf; Author: CERN DEM JLC; CreateDate: 03.12.2007; LatestRevisionDate: 22.04.2015
C79 = CC0402_1NF_50V_10%_X7R: as C2 on sheet Preamp; Part Number: CC0402_1NF_50V_10%_X7R; Component Kind: Standard; Component Type: Standard; Pin Count: 2; Value: 1nF; Status: Not Recommended; Manufacturer Part Number: CC0402_1NF_50V_10%_X7R; Case: 0402; Mounted: Yes; Socket: No; SMD: Yes; Sense: No; Manufacturer1 Example: PHYCOMP; Manufacturer1 ComponentHeight: 0.55mm; HelpURL: \\cern.ch\dfs\Applications\Altium\Datasheets\CC0402_X7R_PHYCOMP.pdf; Author: CERN DEM JLC; CreateDate: 03.12.2007; LatestRevisionDate: 03.12.2007
C80 = CC1206_10UF_25V_10%_X7R: as C3 on sheet Preamp; Part Number: CC1206_10UF_25V_10%_X7R; Component Kind: Standard; Component Type: Standard; Pin Count: 2; Value: 10uF; Status: Preferred; Manufacturer Part Number: CC1206_10uF_25V_10%_X7R; Case: 1206; Mounted: Yes; Socket: No; SMD: Yes; Sense: No; Manufacturer1 Example: KEMET; Manufacturer1 ComponentHeight: 1.8mm; HelpURL: \\cern.ch\dfs\Applications\Altium\Datasheets\CC1206_X7R_KEMET.pdf; Author: CERN DEM JLC; CreateDate: 12.09.2012; LatestRevisionDate: 12.09.2012
IC23 = LEE-39+: as IC1 on sheet Preamp; Part Number: LEE-39+; Component Kind: Standard; Component Type: Standard; Device: LEE-39+; PackageDescription: MINI-CIRCUITS FG873 Case, 4 pin, 3.0mm W X 3.0mm L; Manufacturer Part Number: LEE-39+; Pin Count: 4; Mounted: Yes; Socket: No; SMD: Yes; Sense: No; ComponentHeight: 0.89mm; Author: CERN DEM JLC; HelpURL: \\cern.ch\dfs\Applications\Altium\Datasheets\LEE-39+.pdf; ComponentLink1URL: \\cern.ch\dfs\Applications\Altium\Datasheets\LEE-39+_Package-Drawing.pdf; ComponentLink1Description: Package Drawing; CreateDate: 17.01.2017; LatestRevisionDate: 17.01.2017
L4 = IND_MINI-CIRCUITS_TCCH-80+: as L1 on sheet Preamp; Part Number: IND_MINI-CIRCUITS_TCCH-80+; Component Kind: Standard; Component Type: Standard; Pin Count: 4; Value: 0.5uH@200mA; Status: None; Part Description: 50 Ohms, 50 to 8200 MHz RF Choke; Manufacturer: MINI-CIRCUITS; Manufacturer Part Number: TCCH-80+; Mounted: Yes; Socket: No; SMD: Yes; Sense: No; ComponentHeight: 3.81mm; HelpURL: \\cern.ch\dfs\Applications\Altium\Datasheets\IND_MINI-CIRCUITS_TCCH-80+.pdf; Author: CERN DEM JLC; CreateDate: 19.12.2011; LatestRevisionDate: 19.12.2011
R59 = R0603_43R_1%_0.1W_100PPM: as R58 on sheet Preamp; Part Number: R0603_43R_1%_0.1W_100PPM; Component Kind: Standard; Component Type: Standard; Pin Count: 2; Value: 43; Status: Preferred; Tolerance: ±1%; Manufacturer Part Number: R0603_43R_1%_0.1W_100PPM; Case: 0603; Mounted: Yes; Sense: No; Socket: No; SMD: Yes; Manufacturer1 Example: NIC COMPONENT; Manufacturer1 ComponentHeight: 0.55mm; HelpURL: \\cern.ch\dfs\Applications\Altium\Datasheets\R0603_NIC_NRC.pdf; Author: CERN DEM JLC; CreateDate: 03.12.2007; LatestRevisionDate: 13.03.2008

## Sheet GroundsCoupling.SchDoc: FMC SDR Frontend
size 420 x 297 mm; CheckedBy: -; CompanyName: CERN; DrawnBy: DrawnBy; Organization: CERN; Address1: European Organization for Nuclear Research; Address2: CH-1211 Genčve 23 - Switzerland; Revision: -; SheetNumber: -; SheetTotal: -; EDA_Number: EDA-XXXXX-VX-X; Projet: -; ModifiedBy: -; CreateDate: XX/XX/XXXX; CheckedDate: -; Title2: Grounds and Shield Coupling; DivGrp: TE/MPE; Designer: Designer; ModifiedDate: -
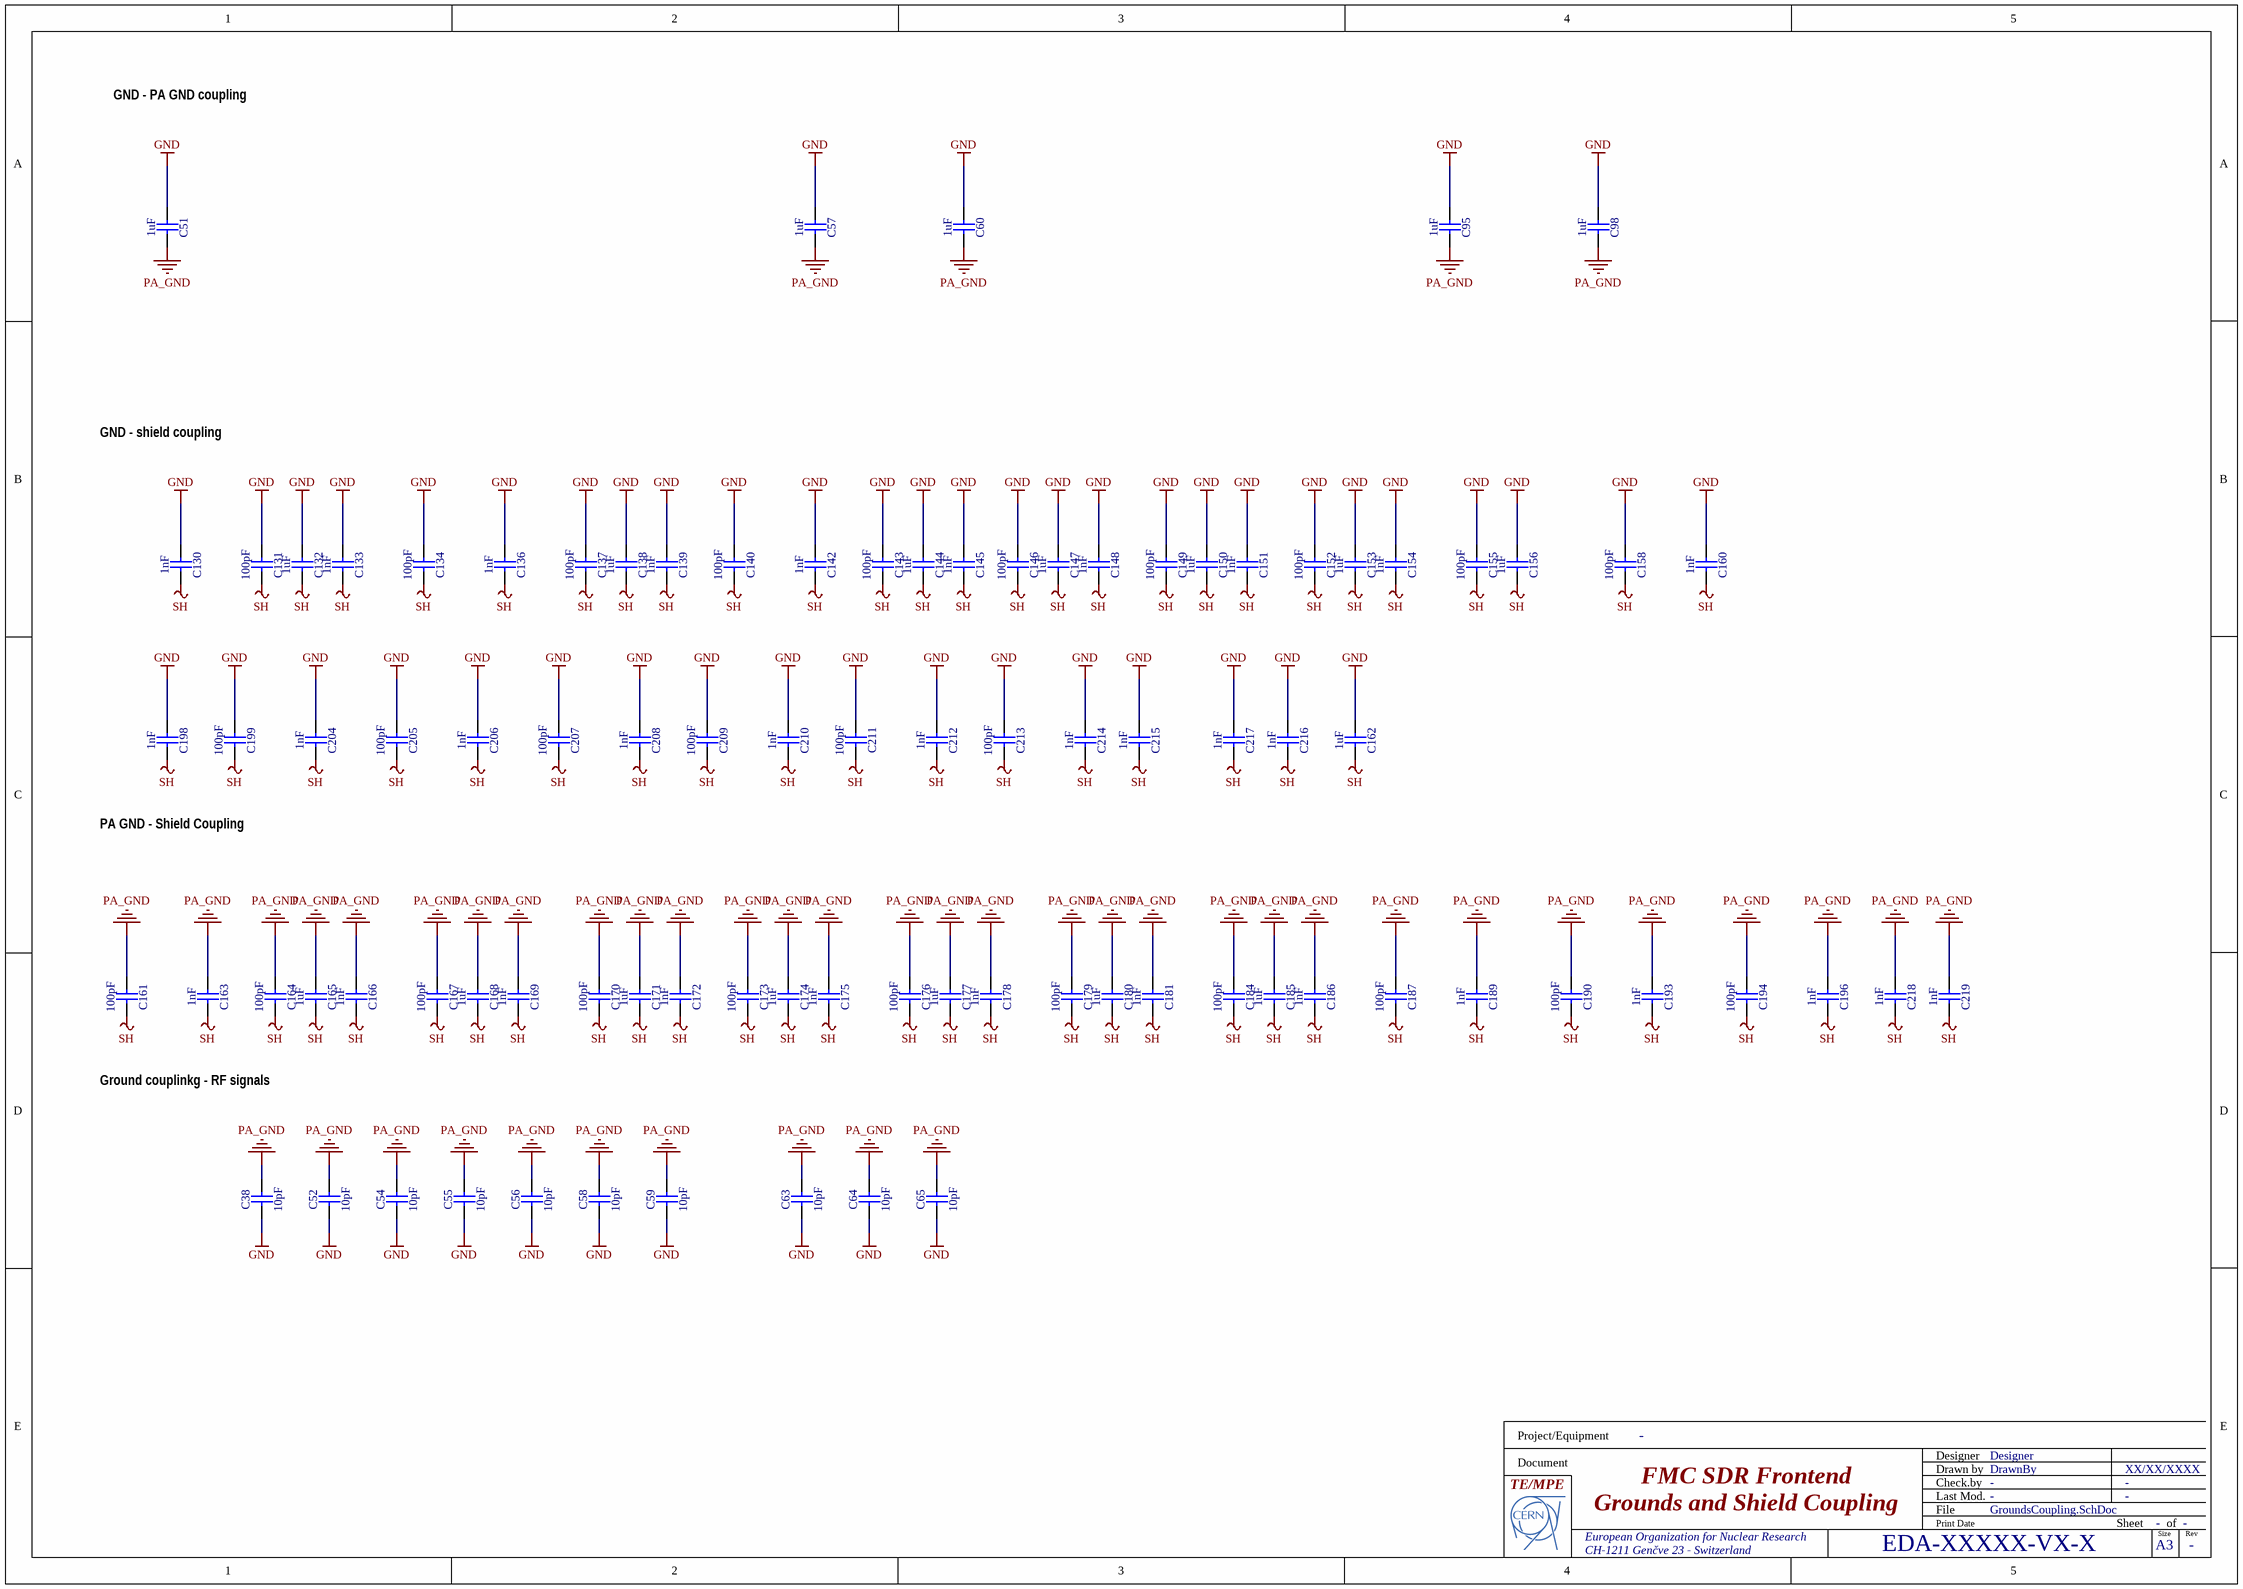
[diagram p13: GroundsCoupling.SchDoc]

### Parts
C38  10pF  [CAPC1005X55N]
C51  1uF  [CAPC3216X140N]
C52  10pF  [CAPC1005X55N]
C54  10pF  [CAPC1005X55N]
C55  10pF  [CAPC1005X55N]
C56  10pF  [CAPC1005X55N]
C57  1uF  [CAPC3216X140N]
C58  10pF  [CAPC1005X55N]
C59  10pF  [CAPC1005X55N]
C60  1uF  [CAPC3216X140N]
C63  10pF  [CAPC1005X55N]
C64  10pF  [CAPC1005X55N]
C65  10pF  [CAPC1005X55N]
C95  1uF  [CAPC3216X140N]
C98  1uF  [CAPC3216X140N]
C130  1nF  [CAPC1005X55N]
C131  100pF  [CAPC1005X55N]
C132  1uF  [CAPC3216X140N]
C133  1nF  [CAPC1005X55N]
C134  100pF  [CAPC1005X55N]
C136  1nF  [CAPC1005X55N]
C137  100pF  [CAPC1005X55N]
C138  1uF  [CAPC3216X140N]
C139  1nF  [CAPC1005X55N]
C140  100pF  [CAPC1005X55N]
C142  1nF  [CAPC1005X55N]
C143  100pF  [CAPC1005X55N]
C144  1uF  [CAPC3216X140N]
C145  1nF  [CAPC1005X55N]
C146  100pF  [CAPC1005X55N]
C147  1uF  [CAPC3216X140N]
C148  1nF  [CAPC1005X55N]
C149  100pF  [CAPC1005X55N]
C150  1uF  [CAPC3216X140N]
C151  1nF  [CAPC1005X55N]
C152  100pF  [CAPC1005X55N]
C153  1uF  [CAPC3216X140N]
C154  1nF  [CAPC1005X55N]
C155  100pF  [CAPC1005X55N]
C156  1uF  [CAPC3216X140N]
C158  100pF  [CAPC1005X55N]
C160  1nF  [CAPC1005X55N]
C161  100pF  [CAPC1005X55N]
C162  1uF  [CAPC3216X140N]
C163  1nF  [CAPC1005X55N]
C164  100pF  [CAPC1005X55N]
C165  1uF  [CAPC3216X140N]
C166  1nF  [CAPC1005X55N]
C167  100pF  [CAPC1005X55N]
C168  1uF  [CAPC3216X140N]
C169  1nF  [CAPC1005X55N]
C170  100pF  [CAPC1005X55N]
C171  1uF  [CAPC3216X140N]
C172  1nF  [CAPC1005X55N]
C173  100pF  [CAPC1005X55N]
C174  1uF  [CAPC3216X140N]
C175  1nF  [CAPC1005X55N]
C176  100pF  [CAPC1005X55N]
C177  1uF  [CAPC3216X140N]
C178  1nF  [CAPC1005X55N]
C179  100pF  [CAPC1005X55N]
C180  1uF  [CAPC3216X140N]
C181  1nF  [CAPC1005X55N]
C184  100pF  [CAPC1005X55N]
C185  1uF  [CAPC3216X140N]
C186  1nF  [CAPC1005X55N]
C187  100pF  [CAPC1005X55N]
C189  1nF  [CAPC1005X55N]
C190  100pF  [CAPC1005X55N]
C193  1nF  [CAPC1005X55N]
C194  100pF  [CAPC1005X55N]
C196  1nF  [CAPC1005X55N]
C198  1nF  [CAPC1005X55N]
C199  100pF  [CAPC1005X55N]
C204  1nF  [CAPC1005X55N]
C205  100pF  [CAPC1005X55N]
C206  1nF  [CAPC1005X55N]
C207  100pF  [CAPC1005X55N]
C208  1nF  [CAPC1005X55N]
C209  100pF  [CAPC1005X55N]
C210  1nF  [CAPC1005X55N]
C211  100pF  [CAPC1005X55N]
C212  1nF  [CAPC1005X55N]
C213  100pF  [CAPC1005X55N]
C214  1nF  [CAPC1005X55N]
C215  1nF  [CAPC1005X55N]
C216  1nF  [CAPC1005X55N]
C217  1nF  [CAPC1005X55N]
C218  1nF  [CAPC1005X55N]
C219  1nF  [CAPC1005X55N]

### Nets
GND: C38.1 C51.1 C52.1 C54.1 C55.1 C56.1 C57.1 C58.1 C59.1 C60.1 C63.1 C64.1 C65.1 C95.1 C98.1 C130.1 C131.1 C132.1 C133.1 C134.1 C136.1 C137.1 C138.1 C139.1 C140.1 C142.1 C143.1 C144.1 C145.1 C146.1 C147.1 C148.1 C149.1 C150.1 C151.1 C152.1 C153.1 C154.1 C155.1 C156.1 C158.1 C160.1 C162.1 C198.1 C199.1 C204.1 C205.1 C206.1 C207.1 C208.1 C209.1 C210.1 C211.1 C212.1 C213.1 C214.1 C215.1 C216.1 C217.1
PA_GND: C38.2 C51.2 C52.2 C54.2 C55.2 C56.2 C57.2 C58.2 C59.2 C60.2 C63.2 C64.2 C65.2 C95.2 C98.2 C161.1 C163.1 C164.1 C165.1 C166.1 C167.1 C168.1 C169.1 C170.1 C171.1 C172.1 C173.1 C174.1 C175.1 C176.1 C177.1 C178.1 C179.1 C180.1 C181.1 C184.1 C185.1 C186.1 C187.1 C189.1 C190.1 C193.1 C194.1 C196.1 C218.1 C219.1
SH: C130.2 C131.2 C132.2 C133.2 C134.2 C136.2 C137.2 C138.2 C139.2 C140.2 C142.2 C143.2 C144.2 C145.2 C146.2 C147.2 C148.2 C149.2 C150.2 C151.2 C152.2 C153.2 C154.2 C155.2 C156.2 C158.2 C160.2 C161.2 C162.2 C163.2 C164.2 C165.2 C166.2 C167.2 C168.2 C169.2 C170.2 C171.2 C172.2 C173.2 C174.2 C175.2 C176.2 C177.2 C178.2 C179.2 C180.2 C181.2 C184.2 C185.2 C186.2 C187.2 C189.2 C190.2 C193.2 C194.2 C196.2 C198.2 C199.2 C204.2 C205.2 C206.2 C207.2 C208.2 C209.2 C210.2 C211.2 C212.2 C213.2 C214.2 C215.2 C216.2 C217.2 C218.2 C219.2

### Notes on the sheet
- GND - PA GND coupling
- GND - shield coupling
- PA GND - Shield Coupling
- Ground couplinkg - RF signals
- Project/Equipment
- Document
- Designer
- Drawn by
- Check.by
- File
- Last Mod.
- Print Date
- Sheet
- Size
- A3
- of
- Rev

### Library data of the parts
C38 C52 C54-C56 C58 C59 C63-C65 = CC0402_10PF_50V_0.5PF_C0G_YUDEN_UMK105CG100DVHF: Non-polarised capacitor; Part Description: SMD Multilayer Ceramic Capacitor (Temperature Compensating Type) for Automotive / Industrial Applications; Manufacturer: TAIYO YUDEN; Voltage: 50V; TC: C0G/NP0; Tolerance: ±0.5pF; Part Number: CC0402_10PF_50V_0.5PF_C0G_YUDEN_UMK105CG100DVHF; Component Kind: Standard; Component Type: Standard; Pin Count: 2; Value: 10pF; Status: Preferred; Manufacturer Part Number: UMK105CG100DVHF; Case: 0402; Mounted: Yes; Socket: No; SMD: Yes; Sense: No; ComponentHeight: 0.55mm; HelpURL: \\cern.ch\dfs\Applications\Altium\Datasheets\CC0402_TAIYO-YUDEN_UMK105CG100DVHF.pdf; Author: CERN DEM JLC; CreateDate: 14.02.2018; LatestRevisionDate: 14.02.2018
C51 C57 C60 C95 C98 C132 C138 C144 C147 C150 C153 C156 C162 C165 C168 C171 C174 C177 C180 C185 = CC1206_1UF_50V_10%_X7R: Non-polarised capacitor; Part Description: SMD Multilayer Chip Ceramic Capacitor; Manufacturer: GENERIC; Manufacturer1 Part Number: C1206F105K5RACTU; Voltage: 50V; TC: X7R; Tolerance: ±10%; Part Number: CC1206_1UF_50V_10%_X7R; Component Kind: Standard; Component Type: Standard; Pin Count: 2; Value: 1uF; Status: Preferred; Manufacturer Part Number: CC1206_1UF_50V_10%_X7R; Case: 1206; Mounted: Yes; Socket: No; SMD: Yes; Sense: No; Manufacturer1 Example: KEMET; Manufacturer1 ComponentHeight: 1.8mm; HelpURL: \\cern.ch\dfs\Applications\Altium\Datasheets\CC1206_X7R_KEMET_OPENMODE.pdf; Author: CERN DEM JLC; CreateDate: 07.11.2012; LatestRevisionDate: 07.11.2012
C130 C133 C136 C139 C142 C145 C148 C151 C154 C160 C163 C166 C169 C172 C175 C178 C181 C186 C189 C193 C196 C198 C204 C206 C208 C210 C212 C214-C219 = CC0402_1NF_50V_10%_X7R: as C2 on sheet Preamp; Part Number: CC0402_1NF_50V_10%_X7R; Component Kind: Standard; Component Type: Standard; Pin Count: 2; Value: 1nF; Status: Not Recommended; Manufacturer Part Number: CC0402_1NF_50V_10%_X7R; Case: 0402; Mounted: Yes; Socket: No; SMD: Yes; Sense: No; Manufacturer1 Example: PHYCOMP; Manufacturer1 ComponentHeight: 0.55mm; HelpURL: \\cern.ch\dfs\Applications\Altium\Datasheets\CC0402_X7R_PHYCOMP.pdf; Author: CERN DEM JLC; CreateDate: 03.12.2007; LatestRevisionDate: 03.12.2007
C131 C134 C137 C140 C143 C146 C149 C152 C155 C158 C161 C164 C167 C170 C173 C176 C179 C184 C187 C190 C194 C199 C205 C207 C209 C211 C213 = CC0402_100PF_50V_5%_C0G: as C46 on sheet PLL; Part Number: CC0402_100PF_50V_5%_C0G; Component Kind: Standard; Component Type: Standard; Pin Count: 2; Value: 100pF; Status: Preferred; Manufacturer Part Number: CC0402_100PF_50V_5%_C0G; Case: 0402; Mounted: Yes; Socket: No; SMD: Yes; Sense: No; Manufacturer1 Example: KEMET; Manufacturer1 ComponentHeight: 0.55mm; HelpURL: \\cern.ch\dfs\Applications\Altium\Datasheets\CC0805_C0G_KEMET_(Commercial Grade).pdf; Author: CERN DEM JLC; CreateDate: 03.12.2007; LatestRevisionDate: 22.04.2015

## Nets that join several sheets
BUCKBOOST_OUT: FrontEnd_PS (R37.2 R38.2), LTM8074_PA (C90.2 IC24.A2 IC24.A3 IC24.A4), LT3080 (R112.1)
FE_3V3: FrontEnd (8 pins), FrontEnd_PS (C202.2 IC14.1 R115.2 R132.2), TGA3042 (C36.1 IC22.7 R78.2), PLL (R88.1)
FE_5V0: FrontEnd_PS (R83.2), PLL (R125.1)
FE_5V0_Preamp: PreampLO_RX (C1_PreampLO_RX.2 C2_PreampLO_RX.2 C3_PreampLO_RX.2 R58_PreampLO_RX.2), PreampRX1 (C1_PreampRX1.2 C2_PreampRX1.2 C3_PreampRX1.2 R58_PreampRX1.2), PreampRX2 (C1_PreampRX2.2 C2_PreampRX2.2 C3_PreampRX2.2 R58_PreampRX2.2)
FE_5V5: FrontEnd_PS (C11.2 R33.2 R70.1 R95.1), LTM8074neg (C41.2 IC13.A3 IC13.A4), FrontEnd_PS/BUCK_5V5 (C40_BUCK_5V5.2 IC3_BUCK_5V5.E1 IC3_BUCK_5V5.E2)
FE_-5V: FrontEnd_PS (C17.2 IC11.2), LTM8074neg (19 pins)
FE_PA_-5V: FrontEnd_PS (C20.2 C182.2 IC4.2 IC12.2), LTM8074neg_PA (19 pins)
FE_PA_VDD: LT3080 (R114.2), TGA3042 (5 pins)
FMC_12V_IN: FrontEnd (BSC19.1), FrontEnd_PS (R10.1 R38.1 R81.1)
GND: FrontEnd (39 pins), FrontEnd_PS (28 pins), LTM8074neg (C41.1 C42.2 IC13.E1 IC13.E2), FrontEnd_PS/BUCK_5V5 (19 pins), FrontEnd_PS/BUCK_3V8 (19 pins), QPA2609 (11 pins), TGA3042 (6 pins), PLL (29 pins), PreampLO_RX (5 pins), PreampRX1 (5 pins), PreampRX2 (5 pins), GroundsCoupling (59 pins)
LNA_3V3: FrontEnd_PS (R90.2), QPA2609 (R61.1)
LNA_VG: FrontEnd_PS (R26.2), QPA2609 (R63.1)
PA_5V: FrontEnd_PS (C203.2 IC18.1 R92.2), PreampLO_TX (C78_PreampLO_TX.2 C79_PreampLO_TX.2 C80_PreampLO_TX.2 R59_PreampLO_TX.2), PreampTX (C78_PreampTX.2 C79_PreampTX.2 C80_PreampTX.2 R59_PreampTX.2)
PA_GND: FrontEnd (23 pins), FrontEnd_PS (23 pins), LTM8056 (92 pins), LTM8074neg_PA (C92.1 C93.2 IC25.E1 IC25.E2), LTM8074_PA (19 pins), LT3080 (5 pins), TGA3042 (16 pins), PreampLO_TX (5 pins), PreampTX (5 pins), GroundsCoupling (46 pins)
PA_VG3: FrontEnd_PS (R31.2), TGA3042 (IC21.15 R47.2 R48.2)
PA_VG12: FrontEnd_PS (R105.2), TGA3042 (IC21.16 R42.2 R46.2)
SH: FrontEnd (13 pins), GroundsCoupling (75 pins)
5356_SPI_CE: FrontEnd (BSC13.1), PLL (R116.1)
5356_SPI_CLK: FrontEnd (BSC8.1 J12.4), PLL (U6.1)
5356_SPI_DATA: FrontEnd (BSC10.1 J12.3), PLL (U6.2)
5356_SPI_LE: FrontEnd (BSC11.1 J12.2), PLL (U6.3)
FE_NSHDN: FrontEnd (BSC17.1), FrontEnd_PS (R28.1 R50.1)
LO_TX: FrontEnd (IC6.8 R106.2), PreampLO_TX (C81_PreampLO_TX.2)
LOCK_DETECT: FrontEnd (BSC20.1), PLL (U6.30)
NetC10_PreampLO_RX_1: FrontEnd (IC8.5), PreampLO_RX (C10_PreampLO_RX.1)
NetC10_PreampRX1_1: FrontEnd (FL5.3), PreampRX1 (C10_PreampRX1.1)
NetC10_PreampRX2_1: PreampRX1 (IC1_PreampRX1.3 L1_PreampRX1.1), PreampRX2 (C10_PreampRX2.1)
NetC12_2: FrontEnd_PS (R37.1), LTM8056 (25 pins)
NetC37_2: FrontEnd (R68.2 R69.1), PLL (C37.2 C46.2)
NetC39_BUCK_3V8_2: FrontEnd_PS (R20.2 R95.2), FrontEnd_PS/BUCK_3V8 (C39_BUCK_3V8.2 IC3_BUCK_3V8.A3 IC3_BUCK_3V8.A4)
NetC39_BUCK_5V5_2: FrontEnd_PS (R10.2 R21.2), FrontEnd_PS/BUCK_5V5 (C39_BUCK_5V5.2 IC3_BUCK_5V5.A2 IC3_BUCK_5V5.A3 IC3_BUCK_5V5.A4)
NetC40_BUCK_3V8_2: FrontEnd_PS (R98.1), FrontEnd_PS/BUCK_3V8 (C40_BUCK_3V8.2 IC3_BUCK_3V8.E1 IC3_BUCK_3V8.E2)
NetC47_1: FrontEnd (R1.2 R72.2), PLL (C47.1 R73.2)
NetC81_PreampTX_2: FrontEnd (R7.2 R8.2), PreampTX (C81_PreampTX.2)
NetC82_PreampLO_TX_1: FrontEnd (IC16.5), PreampLO_TX (C82_PreampLO_TX.1)
NetC82_PreampTX_1: FrontEnd (FL3.3), PreampTX (C82_PreampTX.1)
NetC87_1: FrontEnd (C87.1), PreampRX2 (IC1_PreampRX2.3 L1_PreampRX2.1)
NetC88_1: FrontEnd (C88.1), PreampLO_RX (IC1_PreampLO_RX.3 L1_PreampLO_RX.1)
NetC91_2: FrontEnd_PS (R80.1), LTM8074_PA (C91.2 IC24.E1 IC24.E2)
NetFL1_1: FrontEnd (FL1.1), TGA3042 (IC21.10)
NetFL2_3: FrontEnd (FL2.3), TGA3042 (IC21.2)
NetFL4_1: FrontEnd (FL4.1), QPA2609 (IC20.10)
NetFL6_3: FrontEnd (FL6.3), QPA2609 (IC20.2)
NetIC2_L4: FrontEnd_PS (R150.2), LTM8056 (IC2.L4)
NetIC3_BUCK_3V8_A2: FrontEnd_PS (R20.1 R28.2), FrontEnd_PS/BUCK_3V8 (IC3_BUCK_3V8.A2)
NetIC3_BUCK_3V8_D1: FrontEnd_PS (R19.1), FrontEnd_PS/BUCK_3V8 (IC3_BUCK_3V8.D1)
NetIC3_BUCK_5V5_D1: FrontEnd_PS (R11.1), FrontEnd_PS/BUCK_5V5 (IC3_BUCK_5V5.D1)
NetIC13_A2: FrontEnd_PS (R33.1 R50.2), LTM8074neg (IC13.A2)
NetIC24_D1: FrontEnd_PS (R52.1), LTM8074_PA (IC24.D1)
NetIC25_A2: FrontEnd_PS (R56.1 R57.2), LTM8074neg_PA (IC25.A2)
PA_PS_5V5: FrontEnd_PS (C75.2 R56.2 R80.2 R91.1), LTM8074neg_PA (C92.2 IC25.A3 IC25.A4)
PA_PS_IN: FrontEnd_PS (R81.2 R82.2), LTM8056 (17 pins)
TX_NSHDN: FrontEnd (BSC16.1), FrontEnd_PS (IC14.3)
Vdet: FrontEnd (BSC21.1), TGA3042 (IC22.5 IC22.6)